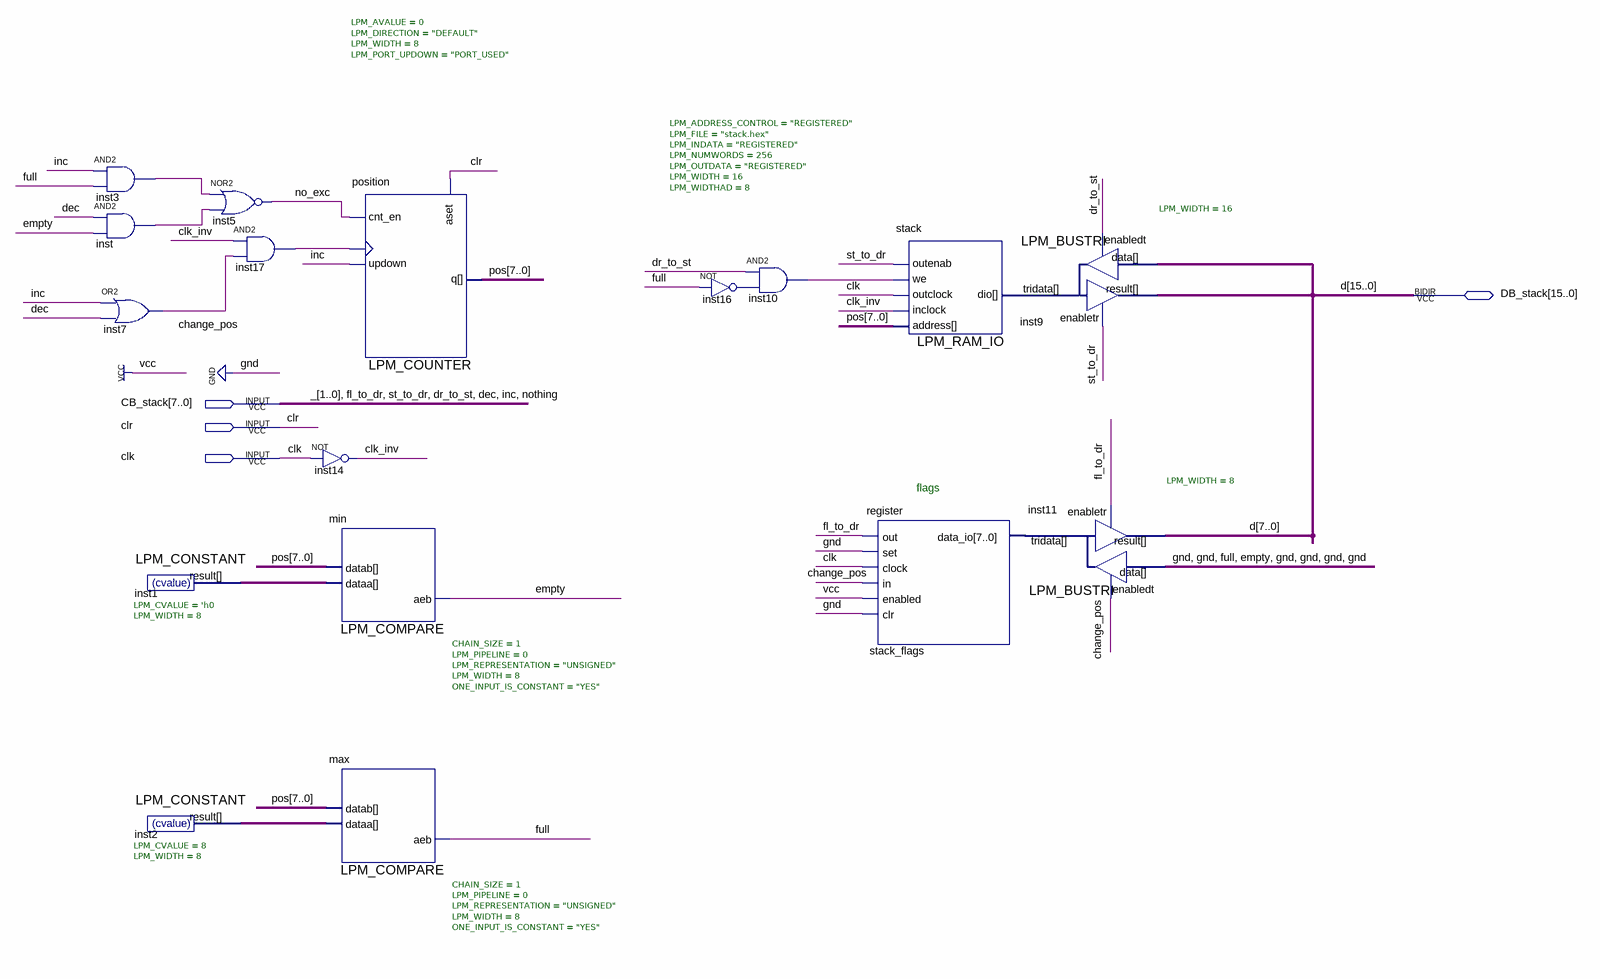
[diagram p0: schematic sheet]
// Quartus schematic stack.bdf as structural Verilog: 17 symbols, 4 pins
module stack (
  input  [7:0] CB_stack,
  input  clr,
  input  clk,
  inout  [15:0] DB_stack
);

  wire change_pos, clk_inv, empty, full, inst3_out, inst10_out, inst16_out, inst17_out, inst_out, no_exc;
  wire [7:0] inst1_result, inst2_result, pos, stack_flags_data_io;
  wire [15:0] stack_dio;

  and inst3 (inst3_out, CB_stack[1], full);
  and inst (inst_out, CB_stack[2], empty);
  or inst7 (change_pos, CB_stack[1], CB_stack[2]);
  LPM_CONSTANT #(.LPM_CVALUE('h0), .LPM_WIDTH(8)) inst1 (.result(inst1_result));
  LPM_CONSTANT #(.LPM_CVALUE(8), .LPM_WIDTH(8)) inst2 (.result(inst2_result));
  nor inst5 (no_exc, inst3_out, inst_out);
  and inst17 (inst17_out, clk_inv, change_pos);
  not inst14 (clk_inv, clk);
  LPM_COMPARE #(.CHAIN_SIZE(1), .LPM_PIPELINE(0), .LPM_REPRESENTATION("UNSIGNED"), .LPM_WIDTH(8), .ONE_INPUT_IS_CONSTANT("YES")) min (
    .dataa(inst1_result), .datab(pos), .aeb(empty));
  LPM_COMPARE #(.CHAIN_SIZE(1), .LPM_PIPELINE(0), .LPM_REPRESENTATION("UNSIGNED"), .LPM_WIDTH(8), .ONE_INPUT_IS_CONSTANT("YES")) max (
    .dataa(inst2_result), .datab(pos), .aeb(full));
  LPM_COUNTER #(.LPM_AVALUE(0), .LPM_DIRECTION("DEFAULT"), .LPM_WIDTH(8), .LPM_PORT_UPDOWN("PORT_USED")) position (
    .clock(inst17_out), .aset(clr), .updown(CB_stack[1]), .cnt_en(no_exc), .q(pos));
  not inst16 (inst16_out, full);
  and inst10 (inst10_out, CB_stack[3], inst16_out);
  LPM_RAM_IO #(.LPM_ADDRESS_CONTROL("REGISTERED"), .LPM_FILE("stack.hex"), .LPM_INDATA("REGISTERED"), .LPM_NUMWORDS(256), .LPM_OUTDATA("REGISTERED"), .LPM_WIDTH(16), .LPM_WIDTHAD(8)) stack (
    .address(pos), .outclock(clk), .inclock(clk_inv), .we(inst10_out), .outenab(CB_stack[4]), .dio(stack_dio));
  register stack_flags (
    .out(CB_stack[5]), .set(1'b0), .clock(clk), .in(change_pos), .enabled(1'b1), .clr(1'b0),
    .data_io(stack_flags_data_io));
  LPM_BUSTRI #(.LPM_WIDTH(16)) inst9 (
    .data(DB_stack), .enabledt(CB_stack[3]), .enabletr(CB_stack[4]), .result(DB_stack), .tridata(stack_dio));
  LPM_BUSTRI #(.LPM_WIDTH(8)) inst11 (
    .data({2'b00, full, empty, 4'b0000}), .enabledt(change_pos), .enabletr(CB_stack[5]),
    .result(DB_stack[7:0]), .tridata(stack_flags_data_io));

  // Other names for the same wires on the sheet: _[1:0] = CB_stack[7:6]; d[15:0] = DB_stack; dec = CB_stack[2];
  //   dr_to_st = CB_stack[3]; fl_to_dr = CB_stack[5]; inc = CB_stack[1]; nothing = CB_stack[0];
  //   st_to_dr = CB_stack[4]

  // Notes on the sheet:
  //   flags
endmodule
